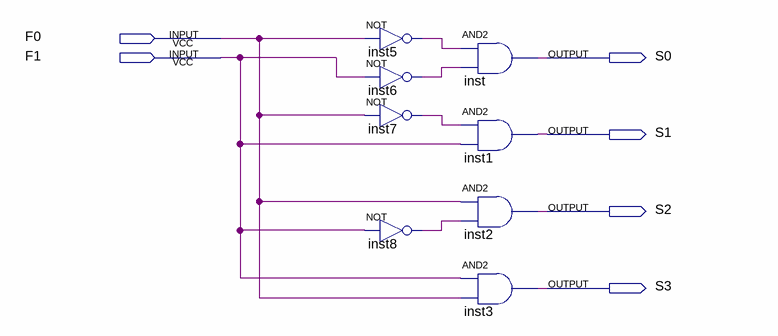
[diagram p0: schematic sheet]
// Quartus schematic DECODER_2T04.bdf as structural Verilog: 8 symbols, 6 pins
module DECODER_2T04 (
  input  F0,
  input  F1,
  output S0,
  output S1,
  output S2,
  output S3
);

  wire inst5_out, inst6_out, inst7_out, inst8_out;

  not inst5 (inst5_out, F0);
  not inst6 (inst6_out, F1);
  not inst7 (inst7_out, F0);
  not inst8 (inst8_out, F1);
  and inst (S0, inst5_out, inst6_out);
  and inst1 (S1, inst7_out, F1);
  and inst2 (S2, F0, inst8_out);
  and inst3 (S3, F1, F0);
endmodule
